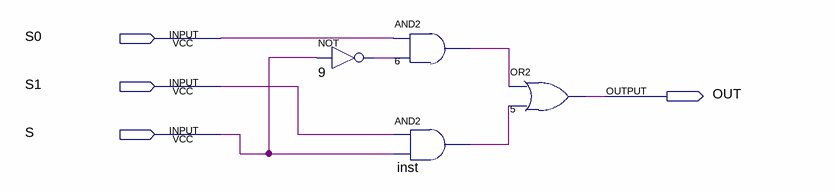
[diagram p0: schematic sheet]
// Quartus schematic Bus.bdf as structural Verilog: 4 symbols, 4 pins
module Bus (
  input  S0,
  input  S1,
  input  S,
  output OUT
);

  wire inst_out, n6_out, n9_out;

  not u_9 (n9_out, S);
  and u_6 (n6_out, S0, n9_out);
  and inst (inst_out, S1, S);
  or u_5 (OUT, n6_out, inst_out);
endmodule
